# EasyEDA schematic SCH_Latencycam_2024-05-11.json
TITLE: Sheet_1; REV: 1.0; Date: 2023-11-19; Sheet: 1/1; Drawn By: t8778108; Company: Your Company
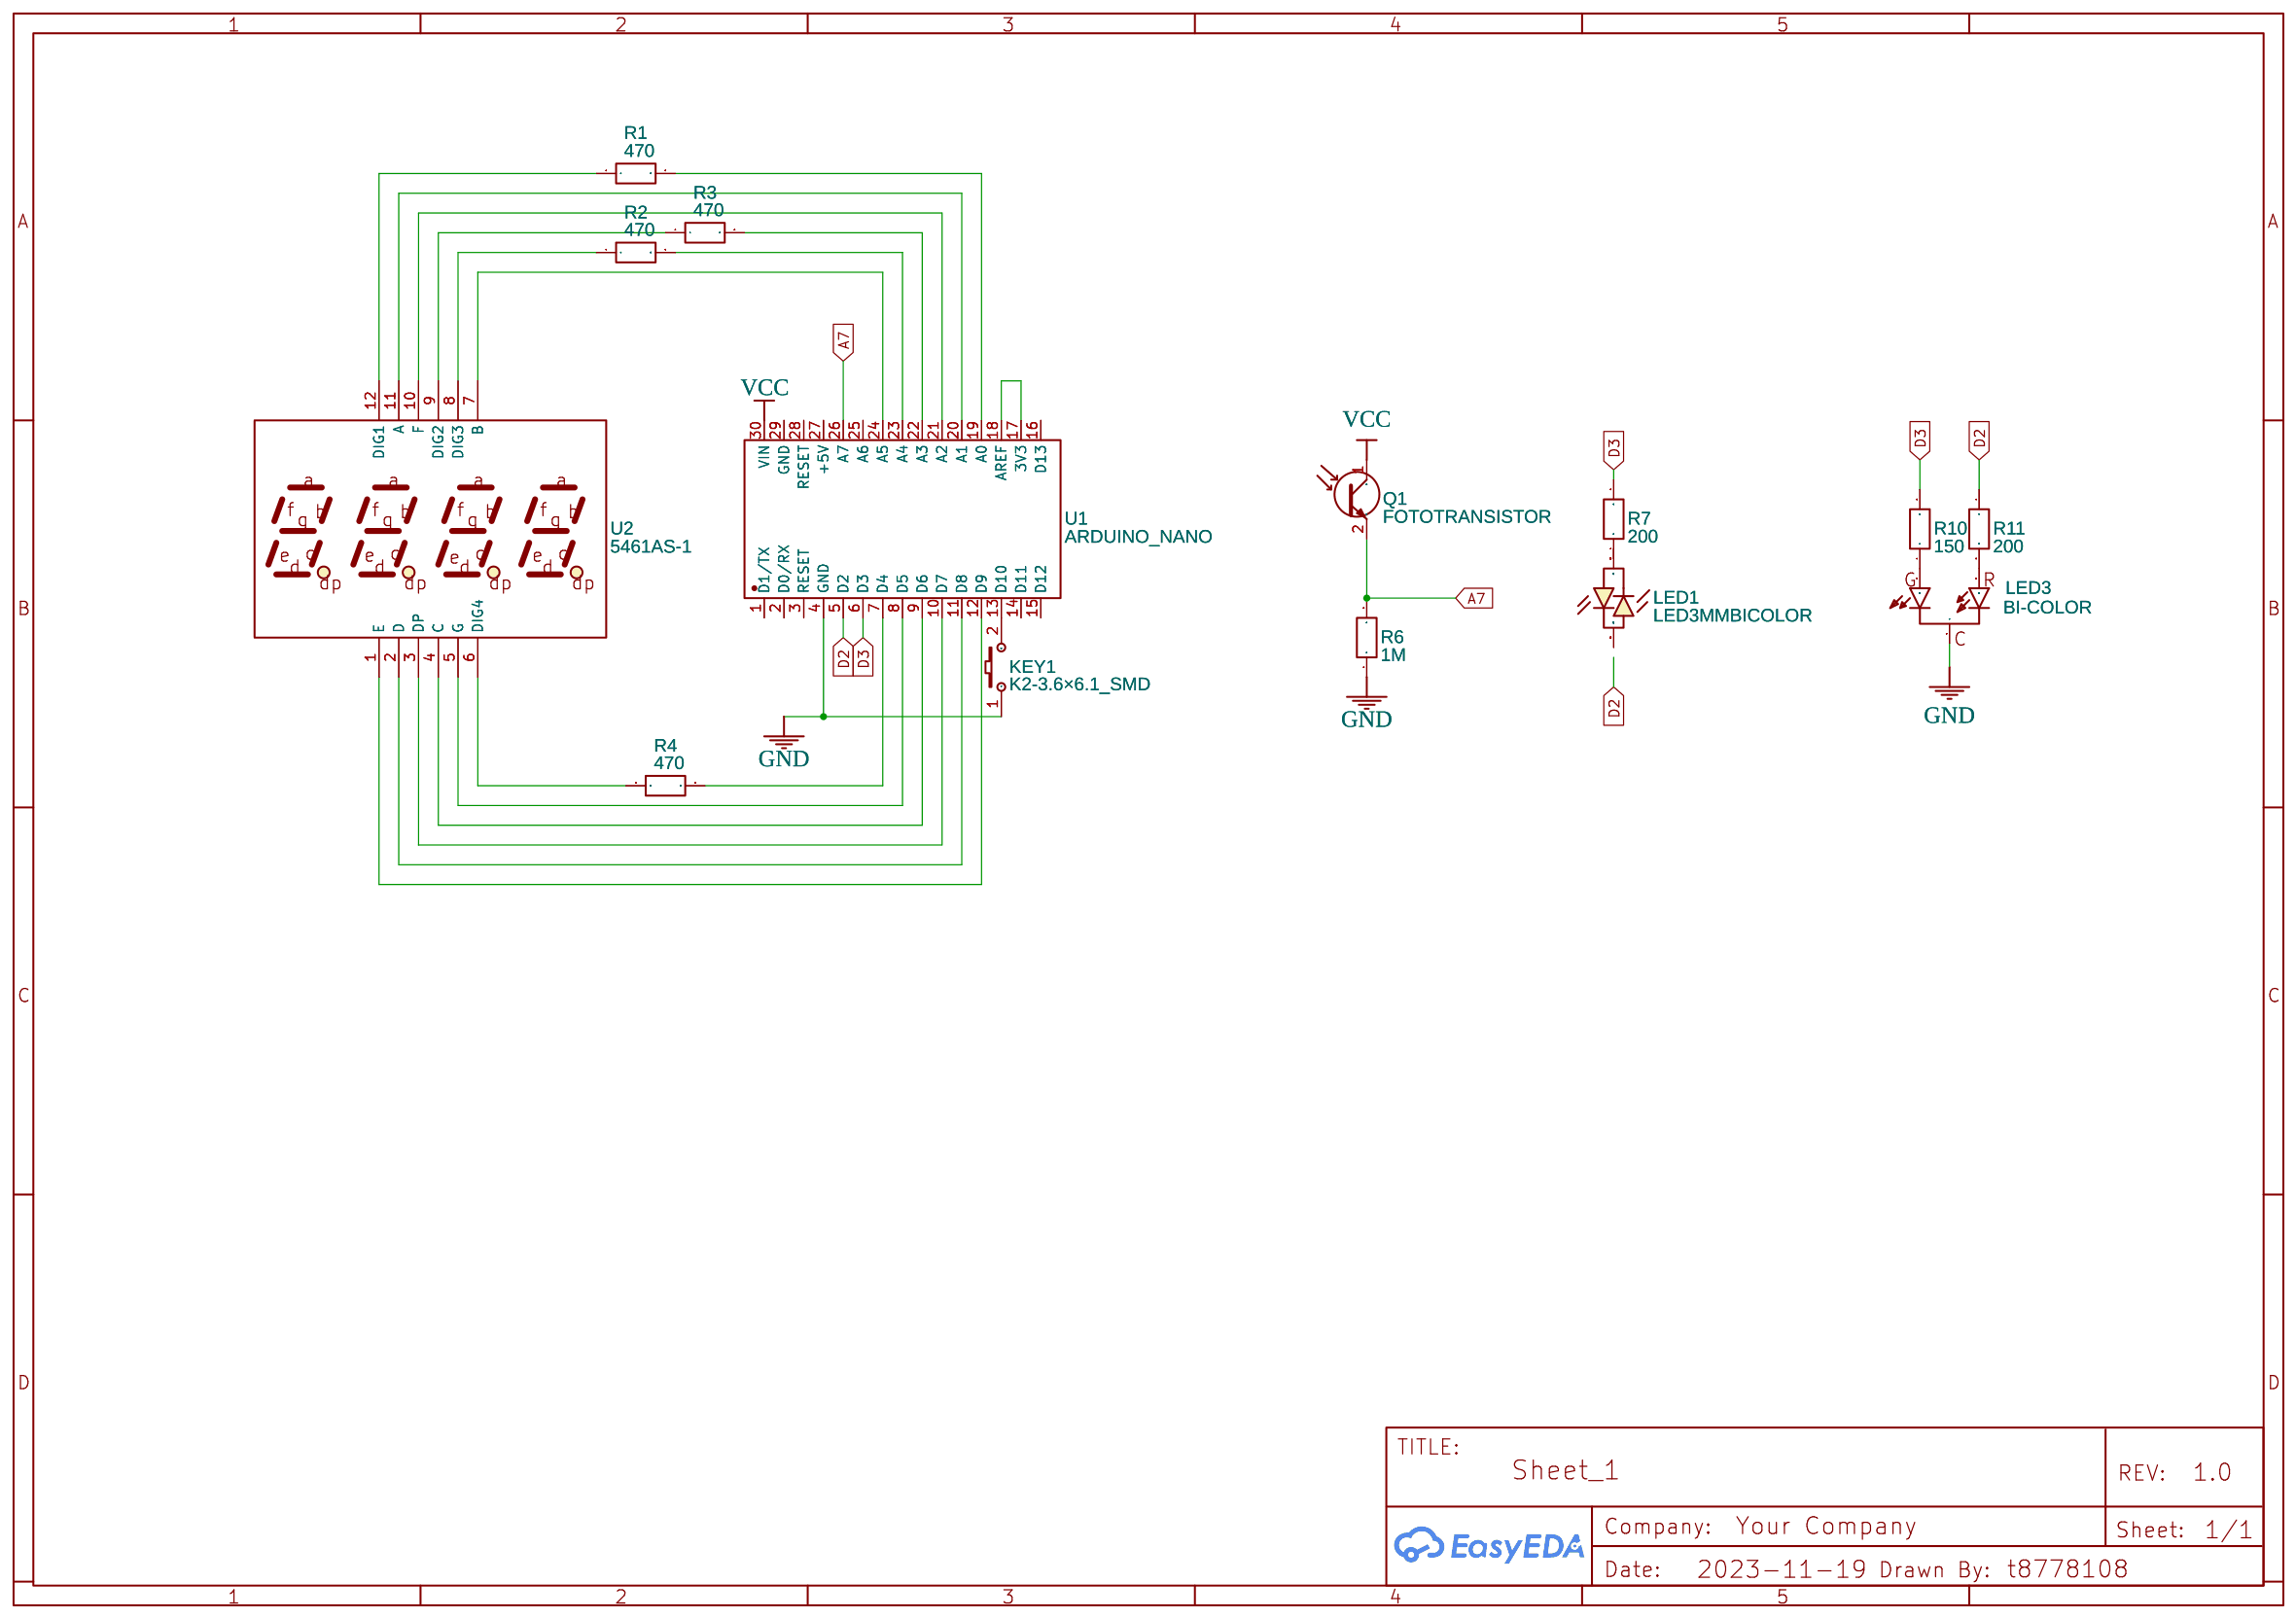
[diagram p0: schematic sheet]

## Parts
KEY1  K2-3.6×6.1_SMD  [KEY-SMD_2P-L6.2-W3.6-LS8.0]
LED1  LED3MMBICOLOR  [LED3MMBICOLOR]
LED3  BI-COLOR  [LED 5MM BI-COLOR]
Q1  FOTOTRANSISTOR  [FOTODIODO]
R1  470  [R0603]
R2  470  [R0603]
R3  470  [R0603]
R4  470  [R0603]
R6  1M  [R0603]
R7  200  [R0603]
R10  150  [R0603]
R11  200  [R0603]
U1  ARDUINO_NANO  [COMM-TH_ARDUINO_NANO]
U2  5461AS-1  [LED-SEG-TH_12P-L50.4-W19.0-P2.54-S15.24-BL]

## Library data of the parts
KEY1 = K2-3.6×6.1_SMD: Supplier Part: C118141; Supplier: LCSC; Manufacturer Part: K2-1107ST-A4SW-06; Contributor: LCEDA_Lib; 制造商: 韩国韩荣
LED1 = LED3MMBICOLOR: LEDs; sourceId: ymfxPJpHZ
LED3 = BI-COLOR LED 5MM COMMON CATHODE COPY: Contributor: Goutham N
Q1 = FOTOTRANSISTOR: Contributor: khrizbusta
R1-R4 R6 R7 R10 R11 = R_0603_EU: Contributor: LCEDA_Lib
U1 = ARDUINO_NANO: Contributor: lcsc; Supplier: LCSC; Supplier Part: C9900017879; Manufacturer: null; JLCPCB Part Class: Extended Part; link: https://lcsc.com/eda_search?q=C9900017879&%26type=1&ref=editor
U2 = 5461AS-1: Contributor: lcsc; Supplier: LCSC; Supplier Part: C9900039509; Manufacturer: null; link: https://lcsc.com/eda_search?q=C9900039509&%26type=1&ref=editor

## Nets
GND: KEY1.1 LED3.2(A) R6.1 U1.4(GND)
VCC: Q1.1(C) U1.30(VIN)
A7: Q1.2(E) R6.2 U1.26(A7)
D2: R11.1 U1.5(D2)
D3: R7.2 R10.2 U1.6(D3)
Net-(KEY1-2): KEY1.2 U1.13(D10)
Net-(LED1-AG-CR): LED1.AG-CR R7.1
Net-(LED3-1): LED3.1(G) R10.1
Net-(LED3-3): LED3.3(R) R11.2
Net-(R1-1): R1.1 U2.12(DIG1)
Net-(R1-2): R1.2 U1.19(A0)
Net-(R2-1): R2.1 U2.8(DIG3)
Net-(R2-2): R2.2 U1.23(A4)
Net-(R3-1): R3.1 U2.9(DIG2)
Net-(R3-2): R3.2 U1.22(A3)
Net-(R4-1): R4.1 U2.6(DIG4)
Net-(R4-2): R4.2 U1.7(D4)
Net-(U1-8): U1.8(D5) U2.5(G)
Net-(U1-9): U1.9(D6) U2.4(C)
Net-(U1-10): U1.10(D7) U2.3(DP)
Net-(U1-11): U1.11(D8) U2.2(D)
Net-(U1-12): U1.12(D9) U2.1(E)
Net-(U1-17): U1.17(3V3) U1.18(AREF)
Net-(U1-20): U1.20(A1) U2.11(A)
Net-(U1-21): U1.21(A2) U2.10(F)
Net-(U1-24): U1.24(A5) U2.7(B)

Not connected (* = marked no-connect by the designer): LED1 CG-AR; U1 1(D1/TX) 2(D0/RX) 3(RESET) 14(D11) 15(D12) 16(D13) 25(A6) 27(+5V) 28(RESET) 29(GND)
